# Altium schematic sheet WX0.011.442DL.SchDoc
size A4
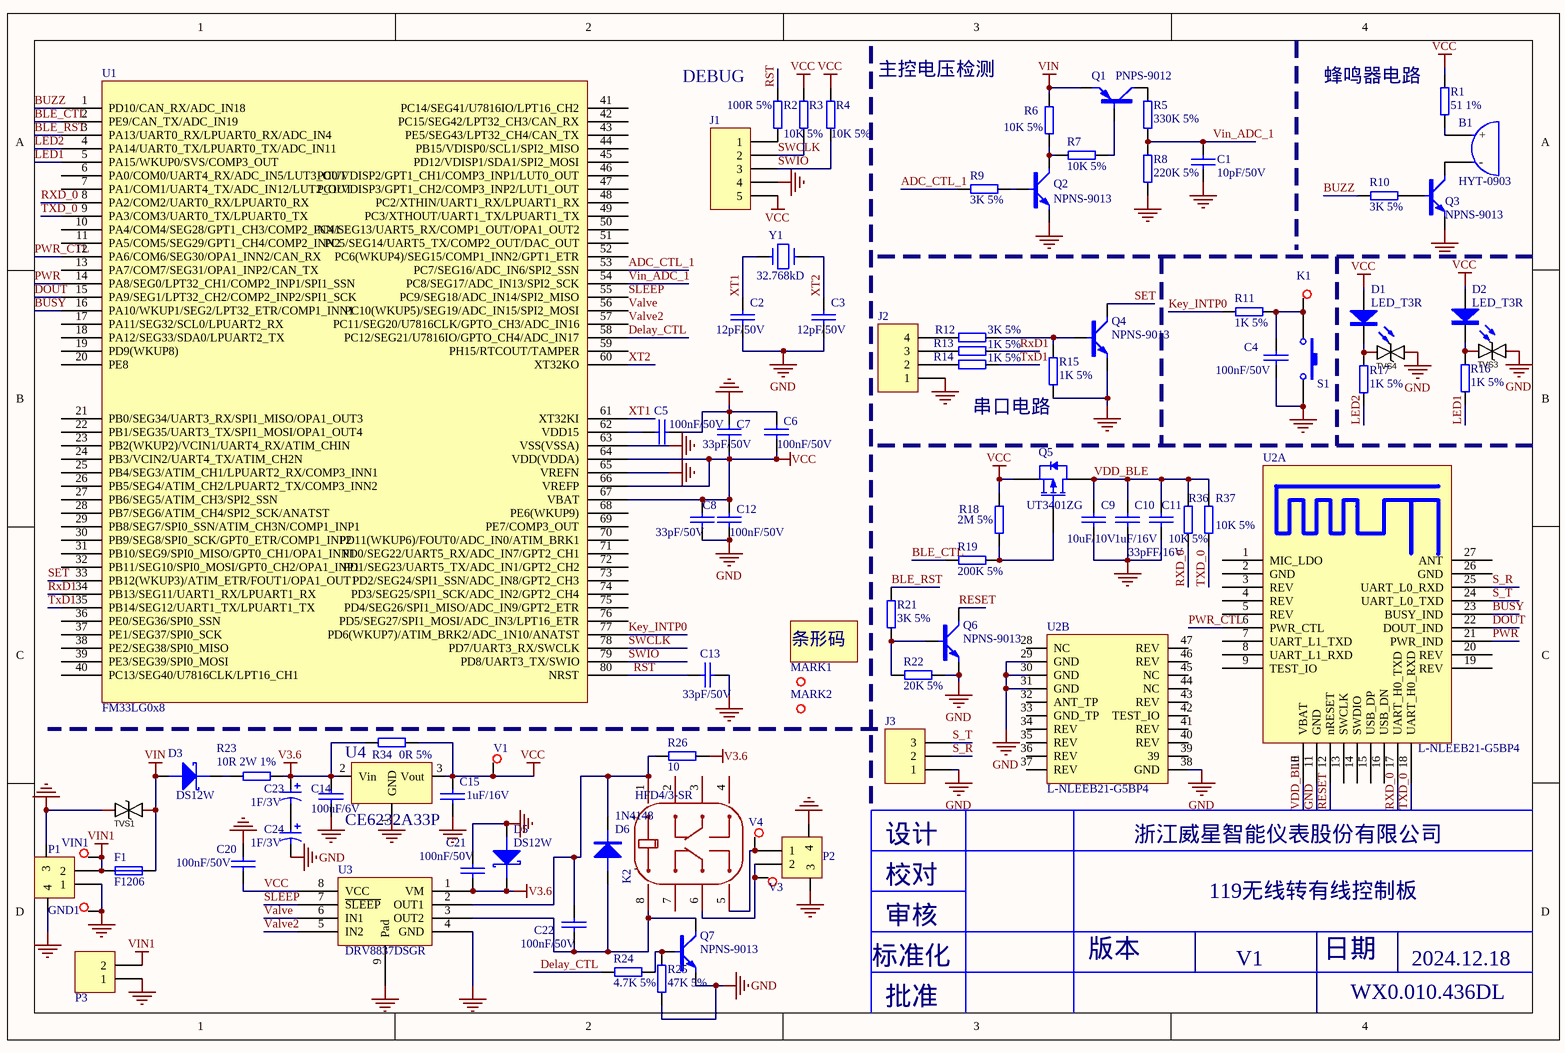
[diagram p0: WX0.011.442DL.SchDoc]

## Parts
*1  Bar Code1  [Bar Code1]  (value not drawn)
B1  HYT-0903  [HYT-0903]
C1  10pF/50V  [CAP0603]
C2  12pF/50V  [CAP0603]
C3  12pF/50V  [CAP0603]
C4  100nF/50V  [CAP0603]
C5  100nF/50V  [CAP0603]
C6  100nF/50V  [CAP0603]
C7  33pF/50V  [CAP0603]
C8  33pF/50V  [CAP0603]
C9  10uF/10V  [CAP0603]
C10  1uF/16V  [CAP0603]
C11  33pFF/16V  [CAP0603]
C12  100nF/50V  [CAP0603]
C13  33pF/50V  [CAP0603]
C14  100uF/6V  [GRM1206]
C15  1uF/16V  [CAP0603]
C20  100nF/50V  [CAP0603]
C21  100nF/50V  [CAP0603]
C22  100nF/50V  [CAP0603]
C23  1F/3V  [CAPPC_350_800_1600R]
C24  1F/3V  [CAPPC_350_800_1600R]
D1  LED_T3R  [LED-SMD-0603 - SMT]
D2  LED_T3R  [LED-SMD-0603 - SMT]
D3  DS12W  [SOD-123FL]
D5  DS12W  [SOD-123FL]
D6  1N4148  [LL34]
F1  F1206  [RES1206]
GND1  TEST-PAD  [TEST-PAD]  (value not drawn)
J1  PIN254_1*5*WXHJ  [PIN254_1*5SR]  (value not drawn)
J2  PIN254_1*4*WXHJ  [PIN254_1*4*1100S]  (value not drawn)
J3  PIN254_1*3  [PIN254_1*3*WXHJ]  (value not drawn)
K1  TEST-PAD  [TEST-PAD]  (value not drawn)
K2  HFD4/3-SR  [RELAY-SMD_HFD4-XX-SR]
MARK1  MARK  [MARK]  (value not drawn)
MARK2  MARK  [MARK]  (value not drawn)
P1  (no value)  [2P_2.0mm]
P2  (no value)
P3  PH200_1*2R  [PH200_1*2R_BAT]  (value not drawn)
Q1  PNPS-9012  [SOT-23]
Q2  NPNS-9013  [SOT-23]
Q3  NPNS-9013  [SOT-23]
Q4  NPNS-9013  [SOT-23]
Q5  UT3401ZG  [SOT-23]
Q6  NPNS-9013  [SOT-23]
Q7  NPNS-9013  [SOT-23]
R1  51 1%  [RES0603]
R2  100R 5%  [RES0603]
R3  10K 5%  [RES0603]
R4  10K 5%  [RES0603]
R5  330K 5%  [RES0603]
R6  10K 5%  [RES0603]
R7  10K 5%  [RES0603]
R8  220K 5%  [RES0603]
R9  3K 5%  [RES0603]
R10  3K 5%  [RES0603]
R11  1K 5%  [RES0603]
R12  3K 5%
R13  1K 5%  [RES0603]
R14  1K 5%  [RES0603]
R15  1K 5%  [RES0603]
R16  1K 5%  [RES0603]
R17  1K 5%  [RES0603]
R18  2M 5%  [RES0603]
R19  200K 5%  [RES0603]
R21  3K 5%  [RES0603]
R22  20K 5%  [RES0603]
R23  10R 2W 1%  [RES2512]
R24  4.7K 5%  [RES0603]
R25  47K 5%  [RES0603]
R26  10  [RES0603]
R34  0R 5%  [RES1206]
R36  10K 5%  [RES0603]
R37  10K 5%  [RES0603]
S1  SWT_4_600_600_430  [SWS_4_600_600]  (value not drawn)
TVS1  (no value)  [DO-214AA]
TVS3  (no value)  [ESD_DFN1006_2L]
TVS4  (no value)  [ESD_DFN1006_2L]
U1  FM33LG0x8  [LQFP80]
U2  L-NLEEB21-G5BP4  [L-NLEEB21-G5BP4]  (parts A,B of 2)
U3  DRV8837DSGR  [S-PWSON-N8]
U4  CE6232A33P  [SOT-89]
V1  TEST-PAD  [TEST-PAD]  (value not drawn)
V3  TEST-PAD  [TEST-PAD]  (value not drawn)
V4  TEST-PAD  [TEST-PAD]  (value not drawn)
VIN1  TEST-PAD  [TEST-PAD]  (value not drawn)
Y1  32.768kD  [SMD-3215_2P]

## Nets
GND: C1.1 C2.2 C3.1 C4.2 C5.2 C6.1 C7.1 C8.2 C9.2 C10.2 C11.2 C12.2 C13.2 C14.2 C15.2 C20.1 C21.2 C24.2 D5.1 GND1.1 J1.4 J2.1 J3.1 P1.1 P1.3 P1.4 P2.3 P2.4 P3.1 Q2.2(E) Q3.2(E) Q4.2(E) Q6.2(E) Q7.2(E) R8.2 R15.1 R22.2 R25.1 S1.2 TVS1.1 TVS3.1 TVS4.1 U1.63(VSS(VSSA)) U1.65(VREFN) U2.11(GND) U2.29(GND) U2.30(GND) U2.31(GND) U2.38(GND) U3.4(GND) U3.9(Pad) U4.1(GND)
V3.6: C14.1 C21.1 C23.1 D5.2 R23.2 R26.2 R34.2 U3.1(VM) U4.2(Vin)
VCC: C6.2 C7.2 C8.1 C12.1 C15.1 C20.2 D1.1 D2.1 J1.5 Q5.2(S) R1.2 R3.1 R4.1 R18.2 R34.1 U1.64(VDD(VDDA)) U1.66(VREFP) U1.67(VBAT) U3.8(VCC) U4.3(Vout) V1.1
VIN: D3.1 F1.2 Q1.2(E) R6.2 TVS1.2
VIN1: F1.1 P1.2 P3.2 VIN1.1
ADC_CTL_1: R9.1 U1.53(PC7/SEG16/ADC_IN6/SPI2_SSN)
BLE_CTL: R19.1 U1.2(PE9/CAN_TX/ADC_IN19)
BLE_RST: R21.1 U1.3(PA13/UART0_RX/LPUART0_RX/ADC_IN4)
BUSY: U1.16(PA10/WKUP1/SEG2/LPT32_ETR/COMP1_INN1) U2.23(BUSY_IND)
BUZZ: R10.1 U1.1(PD10/CAN_RX/ADC_IN18)
Delay_CTL: R24.1 U1.58(PC12/SEG21/U7816IO/GPTO_CH4/ADC_IN17)
DOUT: U1.15(PA9/SEG1/LPT32_CH2/COMP2_INP2/SPI1_SCK) U2.22(DOUT_IND)
Key_INTP0: R11.2 U1.77(PD6(WKUP7)/ATIM_BRK2/ADC_1N10/ANATST)
LED1: R16.1 U1.5(PA15/WKUP0/SVS/COMP3_OUT)
LED2: R17.1 U1.4(PA14/UART0_TX/LPUART0_TX/ADC_IN11)
PWR: U1.14(PA8/SEG0/LPT32_CH1/COMP2_INP1/SPI1_SSN) U2.21(PWR_IND)
PWR_CTL: U1.12(PA6/COM6/SEG30/OPA1_INN2/CAN_RX) U2.6(PWR_CTL)
RESET: Q6.3(C) U2.12(nRESET)
RST: C13.1 R2.1 U1.80(NRST)
RxD1: R13.2 U1.34(PB13/SEG11/UART1_RX/LPUART1_RX)
RXD_0: R36.2 U1.8(PA2/COM2/UART0_RX/LPUART0_RX) U2.17(UART_H0_TXD)
S_R: J3.2 U2.25(UART_L0_RXD)
S_T: J3.3 U2.24(UART_L0_TXD)
SET: Q4.3(C) U1.33(PB12(WKUP3)/ATIM_ETR/FOUT1/OPA1_OUT1)
SLEEP: U1.55(PC9/SEG18/ADC_IN14/SPI2_MISO) U3.7(~{SLEEP})
SWCLK: J1.2 R3.2 U1.78(PD7/UART3_RX/SWCLK)
SWIO: J1.3 R4.2 U1.79(PD8/UART3_TX/SWIO)
TxD1: R14.2 U1.35(PB14/SEG12/UART1_TX/LPUART1_TX)
TXD_0: R37.2 U1.9(PA3/COM3/UART0_TX/LPUART0_TX) U2.18(UART_H0_RXD)
Valve: U1.56(PC10(WKUP5)/SEG19/ADC_IN15/SPI2_MOSI) U3.6(IN1)
Valve2: U1.57(PC11/SEG20/U7816CLK/GPTO_CH3/ADC_IN16) U3.5(IN2)
VDD_BLE: C9.1 C10.1 C11.1 Q5.3(D) R36.1 R37.1 U2.10(VBAT)
Vin_ADC_1: C1.2 R5.2 R8.1 U1.54(PC8/SEG17/ADC_IN13/SPI2_SCK)
XT1: C2.1 U1.61(XT32KI) Y1.1
XT2: C3.2 U1.60(XT32KO) Y1.2
NetB1_1: B1.1(+) R1.1
NetB1_2: B1.2(-) Q3.3(C)
NetC4_1: C4.1 K1.1 R11.1 S1.1
NetC5_1: C5.1 U1.62(VDD15)
NetC22_1: C22.1 D6.2(K) K2.1 R26.1 U3.2(OUT1)
NetC22_2: C22.2 D6.1(A) K2.8 Q7.3(C) U3.3(OUT2)
NetC23_2: C23.2 C24.1
NetD1_2: D1.2 R17.2 TVS4.2
NetD2_2: D2.2 R16.2 TVS3.2
NetD3_2: D3.2 R23.1
NetJ1_1: J1.1 R2.2
NetJ2_2: J2.2 R14.1
NetJ2_3: J2.3 R13.1
NetJ2_4: J2.4 R12.1
NetK2_5: K2.5 P2.1 V4.1
NetK2_6: K2.6 P2.2 V3.1
NetQ1_1: Q1.1(B) R7.2
NetQ1_3: Q1.3(C) R5.1
NetQ2_1: Q2.1(B) R9.2
NetQ2_3: Q2.3(C) R6.1 R7.1
NetQ3_1: Q3.1(B) R10.2
NetQ4_1: Q4.1(B) R12.2 R15.2
NetQ5_1: Q5.1(G) R18.1 R19.2
NetQ6_1: Q6.1(B) R21.2 R22.1
NetQ7_1: Q7.1(B) R24.2 R25.2

Not connected (* = marked no-connect by the designer): K2 2 3 4 7; U1 6(PA0/COM0/UART4_RX/ADC_IN5/LUT3_OUT) 7(PA1/COM1/UART4_TX/ADC_IN12/LUT2_OUT) 10(PA4/COM4/SEG28/GPT1_CH3/COMP2_INN1) 11(PA5/COM5/SEG29/GPT1_CH4/COMP2_INN2) 13(PA7/COM7/SEG31/OPA1_INP2/CAN_TX) 17(PA11/SEG32/SCL0/LPUART2_RX) 18(PA12/SEG33/SDA0/LPUART2_TX) 19(PD9(WKUP8)) 20(PE8) 21(PB0/SEG34/UART3_RX/SPI1_MISO/OPA1_OUT3) 22(PB1/SEG35/UART3_TX/SPI1_MOSI/OPA1_OUT4) 23(PB2(WKUP2)/VCIN1/UART4_RX/ATIM_CHIN) 24(PB3/VCIN2/UART4_TX/ATIM_CH2N) 25(PB4/SEG3/ATIM_CH1/LPUART2_RX/COMP3_INN1) 26(PB5/SEG4/ATIM_CH2/LPUART2_TX/COMP3_INN2) 27(PB6/SEG5/ATIM_CH3/SPI2_SSN) 28(PB7/SEG6/ATIM_CH4/SPI2_SCK/ANATST) 29(PB8/SEG7/SPI0_SSN/ATIM_CH3N/COMP1_INP1) 30(PB9/SEG8/SPI0_SCK/GPT0_ETR/COMP1_INP2) 31(PB10/SEG9/SPI0_MISO/GPT0_CH1/OPA1_INN1) 32(PB11/SEG10/SPI0_MOSI/GPT0_CH2/OPA1_INP1) 36(PE0/SEG36/SPI0_SSN) 37(PE1/SEG37/SPI0_SCK) 38(PE2/SEG38/SPI0_MISO) 39(PE3/SEG39/SPI0_MOSI) 40(PC13/SEG40/U7816CLK/LPT16_CH1) 41(PC14/SEG41/U7816IO/LPT16_CH2) 42(PC15/SEG42/LPT32_CH3/CAN_RX) 43(PE5/SEG43/LPT32_CH4/CAN_TX) 44(PB15/VDISP0/SCL1/SPI2_MISO) 45(PD12/VDISP1/SDA1/SPI2_MOSI) 46(PC0/VDISP2/GPT1_CH1/COMP3_INP1/LUT0_OUT) 47(PC1/VDISP3/GPT1_CH2/COMP3_INP2/LUT1_OUT) 48(PC2/XTHIN/UART1_RX/LPUART1_RX) 49(PC3/XTHOUT/UART1_TX/LPUART1_TX) 50(PC4/SEG13/UART5_RX/COMP1_OUT/OPA1_OUT2) 51(PC5/SEG14/UART5_TX/COMP2_OUT/DAC_OUT) 52(PC6(WKUP4)/SEG15/COMP1_INN2/GPT1_ETR) 59(PH15/RTCOUT/TAMPER) 68(PE6(WKUP9)) 69(PE7/COMP3_OUT) 70(PD11(WKUP6)/FOUT0/ADC_IN0/ATIM_BRK1) 71(PD0/SEG22/UART5_RX/ADC_IN7/GPT2_CH1) 72(PD1/SEG23/UART5_TX/ADC_IN1/GPT2_CH2) 73(PD2/SEG24/SPI1_SSN/ADC_IN8/GPT2_CH3) 74(PD3/SEG25/SPI1_SCK/ADC_IN2/GPT2_CH4) 75(PD4/SEG26/SPI1_MISO/ADC_IN9/GPT2_ETR) 76(PD5/SEG27/SPI1_MOSI/ADC_IN3/LPT16_ETR); U2 1(MIC_LDO) 2(GND) 3(REV) 4(REV) 5(REV) 7(UART_L1_TXD) 8(UART_L1_RXD) 9(TEST_IO) 13(SWCLK) 14(SWDIO) 15(USB_DP) 16(USB_DN) 19(REV) 20(REV) 26(GND) 27(ANT) 28(NC) 32(ANT_TP) 33(GND_TP) 34(REV) 35(REV) 36(REV) 37(REV) 39 40(REV) 41(REV) 42(TEST_IO) 43(REV) 44(NC) 45(NC) 46(REV) 47(REV)

## Notes on the sheet
- DEBUG
- 主控电压检测
- 蜂鸣器电路
- 串口电路
- 设计
- 浙江威星智能仪表股份有限公司
- 校对
- 审核
- 119无线转有线控制板
- 标准化
- 版本
- V1
- 日期
- 2024.12.18
- 批准
- WX0.010.436DL
- Labels drawn without touching a wire or pin: GND
- (in symbol HFD4/3-SR) +; -

## Library data of the parts
*1 = AD_WXHJ_Bar Code_02: 条形码 ,填充，无需焊接器件; SMD/DIP: SMD; ID: 17; Part Number: AD_WXHJ_Bar Code_02; Part Name: 条形码
B1 = 1010602-0007: 直插,直径9mm,高5.5mm,5 V,2 V,30 mA,兴化市华宇电子有限公司,HYT-0903; Part Name: 有源蜂鸣器; ID: 28; SMD/DIP: DIP; Part Number: 1010602-0007
C1 = 101020103-0014: 10pF,50 V,±5%,0603,X7R,国巨,CC0603JRNPO9BN100; Part Name: 0603贴片电容; ID: 7; SMD/DIP: SMD; Part Number: 101020103-0014
C2 C3 = 101020103-0005: 12P,50 V,±5%,0603,国巨,CC0603JRNPO9BN12; Part Name: 0603贴片电容; ID: 11; SMD/DIP: SMD; Part Number: 101020103-0005
C4-C6 C12 C22 = 101020103-0021: 104pF,50 V,±10%,0603,国巨,CC0603KRX7R9BB104; Part Name: 0603贴片电容; ID: 3; SMD/DIP: SMD; Part Number: 101020103-0021
C7 C8 C13 = 101020103-0027: 33pF,50 V,±10%,0603,国巨,CC0603KRNPO9BN33; Part Name: 0603贴片电容; ID: 17; SMD/DIP: SMD; Part Number: 101020103-0027
C9 = 101020103-0026: 106pF,10 V,±10%,0603,村田,GRM188R61A106KE47D; Part Name: 0603贴片电容; ID: 8; SMD/DIP: SMD; Part Number: 101020103-0026
C10 C11 C15 = 101020103-0003: 105pF,16 V,±10%,0603,国巨,CC0603KRX7R7BB105; Part Name: 0603贴片电容; ID: 14; SMD/DIP: SMD; Part Number: 101020103-0003
C14 = 101020102-0012: 226P,10 V,±20%,0805,村田电子有限公司,GRM21BR61A226ME51L; Part Name: 贴片电容; ID: 20; SMD/DIP: SMD; Part Number: 101020102-0012
C20 C21 = 101020103-0021: 104pF,50 V,±10%,0603,国巨,CC0603KRX7R9BB104; Part Name: 0603贴片电容; ID: 12; SMD/DIP: SMD; Part Number: 101020103-0021
C23 C24 = 1010202-0015: 1F,2.75 V,-20%~+20%,8mm*16mm,红宝石,2.7 DMC 1 M MY4 8X16; Part Name: 法拉电容; ID: 12; SMD/DIP: DIP; Part Number: 1010202-0015
D1 D2 = 101040102-0001: 圆形插件,3mm 圆形,插件,红光,湖北匡通电子有限公司,3BB4HC; Part Name: 发光二极管; ID: 6; SMD/DIP: DIP; Part Number: 101040102-0001
D3 D5 = 101040101-0055: DS36W,SOD123-FL,3 A,42 V,60 V,浙江领晨科技有限公司,DS36W; Part Name: 贴片肖特基; ID: 40; SMD/DIP: SMD; Part Number: 101040101-0055
D6 = DIODE: 二极管，Diode
GND1 K1 V1 V3 V4 VIN1 = AD_WXHJ_TEST-PAD_01: 单面焊盘测试点; Part Name: 测试点; ID: 23; SMD/DIP: SMD; Part Number: AD_WXHJ_TEST-PAD_01
J1 = AD_WXHJ_PinHeader_02: 1*5 ，Φ1.0 ，2.54mm，直脚,无需焊接器件; Part Name: 排针; ID: 17; SMD/DIP: DIP; Part Number: AD_WXHJ_PinHeader_02
J2 = AD_WXHJ_PinHeader_01: 1*4 ，Φ1.0 ，2.54mm，直脚,无需焊接器件; Part Name: 排针; ID: 16; SMD/DIP: DIP; Part Number: AD_WXHJ_PinHeader_01
K2 = HFD4/3-SR: Manufacturer: HF(宏发); Add into BOM: yes; Coil Voltage: 3V; Contact Form: 两组转换:2C(双刀双掷-转换); Pin Number: 8; Contact Rating: 1A@30VDC；300mA@125VAC; Maximum Switching Voltage: 250V@AC；220V@DC; Coil Rated Power: 140mW; Coil Resistance: 64.3Ω; Maximum Switching Current: 2A; Operate Time: 3ms; Coil Type: 有极性-单线圈; Contact Resistance: 100mΩ; Symbol: HFD4/3-S; Device: HFD4/3-SR; LCSC Part Name: 超小型3V继电器 双刀双掷; Supplier Part: C90259; Manufacturer Part: HFD4/3-SR; Supplier Footprint: SMD,6.5x10mm; JLCPCB Part Class: Extended Part; Datasheet: https://atta.szlcsc.com/upload/public/pdf/source/20180416/C190593_C78D568AD612E1D8EA4C5806717C8D28.pdf; Supplier: LCSC; Convert to PCB: yes; Contact Material: AgNi+镀金; Release Time: 3ms; Operating Temperature: -40℃~+85℃
MARK1 MARK2 = AD_WXHJ_MARK_01: MARK点; ID: 8; SMD/DIP: SMD; Part Number: AD_WXHJ_MARK_01; Part Name: MARK点
P1 P2 = SMT_2.0_卧
P3 = PH200_1*2R: 2.0-2AW,直插弯座，2PIN，脚间距2mm，带防翘起,公头,单排,2.0-2AW;直插弯座，2PIN,脚间距2mm，带防翘起; Part Number: 1010902-0105; Part Name: PH座; ID: 11; SMD/DIP: DIP
Q1 = 101040201-0001: 9012,PNP,SOT-23,JCET;长电,S9012; Part Name: 贴片三极管; ID: 17; SMD/DIP: SMD; Part Number: 101040201-0001
Q2 Q6 Q7 = 101040201-0002: 9013,NPN,SOT-23,长电,S9013; Part Name: 贴片三极管; ID: 15; SMD/DIP: SMD; Part Number: 101040201-0002
Q3 Q4 = 101040201-0002: 9013,NPN,SOT-23,长电,S9013; Part Name: 贴片三极管; ID: 14; SMD/DIP: SMD; Part Number: 101040201-0002
Q5 = 101040201-0013: UT3401ZG,P-MOS,SOT-23,UTC,UT3401ZG; Part Name: 功率MOS管; ID: 18; SMD/DIP: SMD; Part Number: 101040201-0013
R1 = 101010103-0037: 国巨,±5%,0603,,155 ℃,-55 ℃,RC0603JR-0751RL,无铅,100 ppm/℃,1/10W,,51欧; Part Name: 0603贴片电阻; ID: 28; SMD/DIP: SMD; Part Number: 101010103-0037
R2 = 101010103-0022: 100R,±5%,1/10W,0603,国巨,RC0603JR-07100RL; Part Name: 0603贴片电阻; ID: 5; SMD/DIP: SMD; Part Number: 101010103-0022
R3 R4 R6 R7 R36 R37 = 101010103-0003: 国巨,±5%,0603,,155 ℃,-55 ℃,RC0603JR-0710KL,无铅,200 ppm/℃,1/10W,,10K; Part Name: 0603贴片电阻; ID: 7; SMD/DIP: SMD; Part Number: 101010103-0003
R5 = 101010103-0066: 330K,±5%,1/10W,0603,国巨,RC0603JR-07330KL; Part Name: 0603贴片电阻; ID: 31; SMD/DIP: SMD; Part Number: 101010103-0066
R8 = 101010103-0044: 220K,±5%,1/10W,0603,国巨,RC0603JR-07220KL; Part Name: 0603贴片电阻; ID: 30; SMD/DIP: SMD; Part Number: 101010103-0044
R9 R21 R24 R26 = 101010103-0006: 国巨,±5%,0603,,155 ℃,-55 ℃,RC0603JR-073KL,无铅,100 ppm/℃,1/10W,,3K; Part Name: 0603贴片电阻; ID: 23; SMD/DIP: SMD; Part Number: 101010103-0006
R10-R12 = 101010103-0006: 国巨,±5%,0603,,155 ℃,-55 ℃,RC0603JR-073KL,无铅,100 ppm/℃,1/10W,,3K; Part Name: 0603贴片电阻; ID: 22; SMD/DIP: SMD; Part Number: 101010103-0006
R13-R17 R34 = 101010103-0008: 1K,±5%,1/10W,0603,国巨,RC0603JR-071KL; Part Name: 0603贴片电阻; ID: 9; SMD/DIP: SMD; Part Number: 101010103-0008
R18 = 101010103-0025: 国巨,±5%,0603,,155 ℃,-55 ℃,RC0603JR-072ML,含铅,100 ppm/℃,1/10W,,2M; Part Name: 0603贴片电阻; ID: 20; SMD/DIP: SMD; Part Number: 101010103-0025
R19 = 101010103-0003: 10K±5%,1/10W,0603; Part Name: 0603贴片电阻; ID: 32; Part Number: 101010103-0003
R22 R25 = 101010103-0004: 国巨,±5%,0603,,155 ℃,-55 ℃,RC0603JR-0720KL,无铅,200 ppm/℃,1/10W,,20K; Part Name: 0603贴片电阻; ID: 15; SMD/DIP: SMD; Part Number: 101010103-0004
R23 = 101010105-0001: 0.5Ω,±1%,1W,2512,国巨,RC2512FR-070R5L; Part Name: 2512贴片电阻; ID: 33; SMD/DIP: SMD; Part Number: 101010105-0001
S1 = 1011001-0027: TS-1102,机械轻触,6*6*4.3直插,6*6*4.3直插,乐清市羽欧电子; Part Name: 按键; ID: 30; SMD/DIP: DIP; Part Number: 1011001-0027
TVS1 TVS3 TVS4 = SMBJ12CA: Manufacturer: AnBon(台湾安邦); Symbol: SMBJ12CA_C440277; Add into BOM: yes; Polarity: 双向; Reverse Stand-Off Voltage (Vrwm): 12V; Breakdown Voltage (Min): 13.3V; Peak Pulse Current (Ipp)@10/1000μs: 30.2A; Maximum Clamping Voltage: 19.9V; Name: SMBJ12CA; Device: SMBJ12CA; LCSC Part Name: 双向 12V; Supplier Part: C440277; Manufacturer Part: SMBJ12CA; Supplier Footprint: SMB; JLCPCB Part Class: Extended Part; Datasheet: https://atta.szlcsc.com/upload/public/pdf/source/20191022/C440277_B37F7E4C8A16D21B347D24F638F34B23.pdf; Supplier: LCSC; Convert to PCB: yes
U3 = 101050101-0060: DRV8837DSGR,S-PWSON-N8,TI,DRV8837DSGR; Part Name: 驱动芯片; ID: 25; SMD/DIP: SMD; Part Number: 101050101-0060
U4 = 02_CE6232A33P
Y1 = 1010601-0009: Part Number: 1010601-0020; Part Name: 贴片晶振; ID: 20; SMD/DIP: SMD